# EAGLE design AnalogInputModule2_r1_1 (EAGLE 9.6.2)
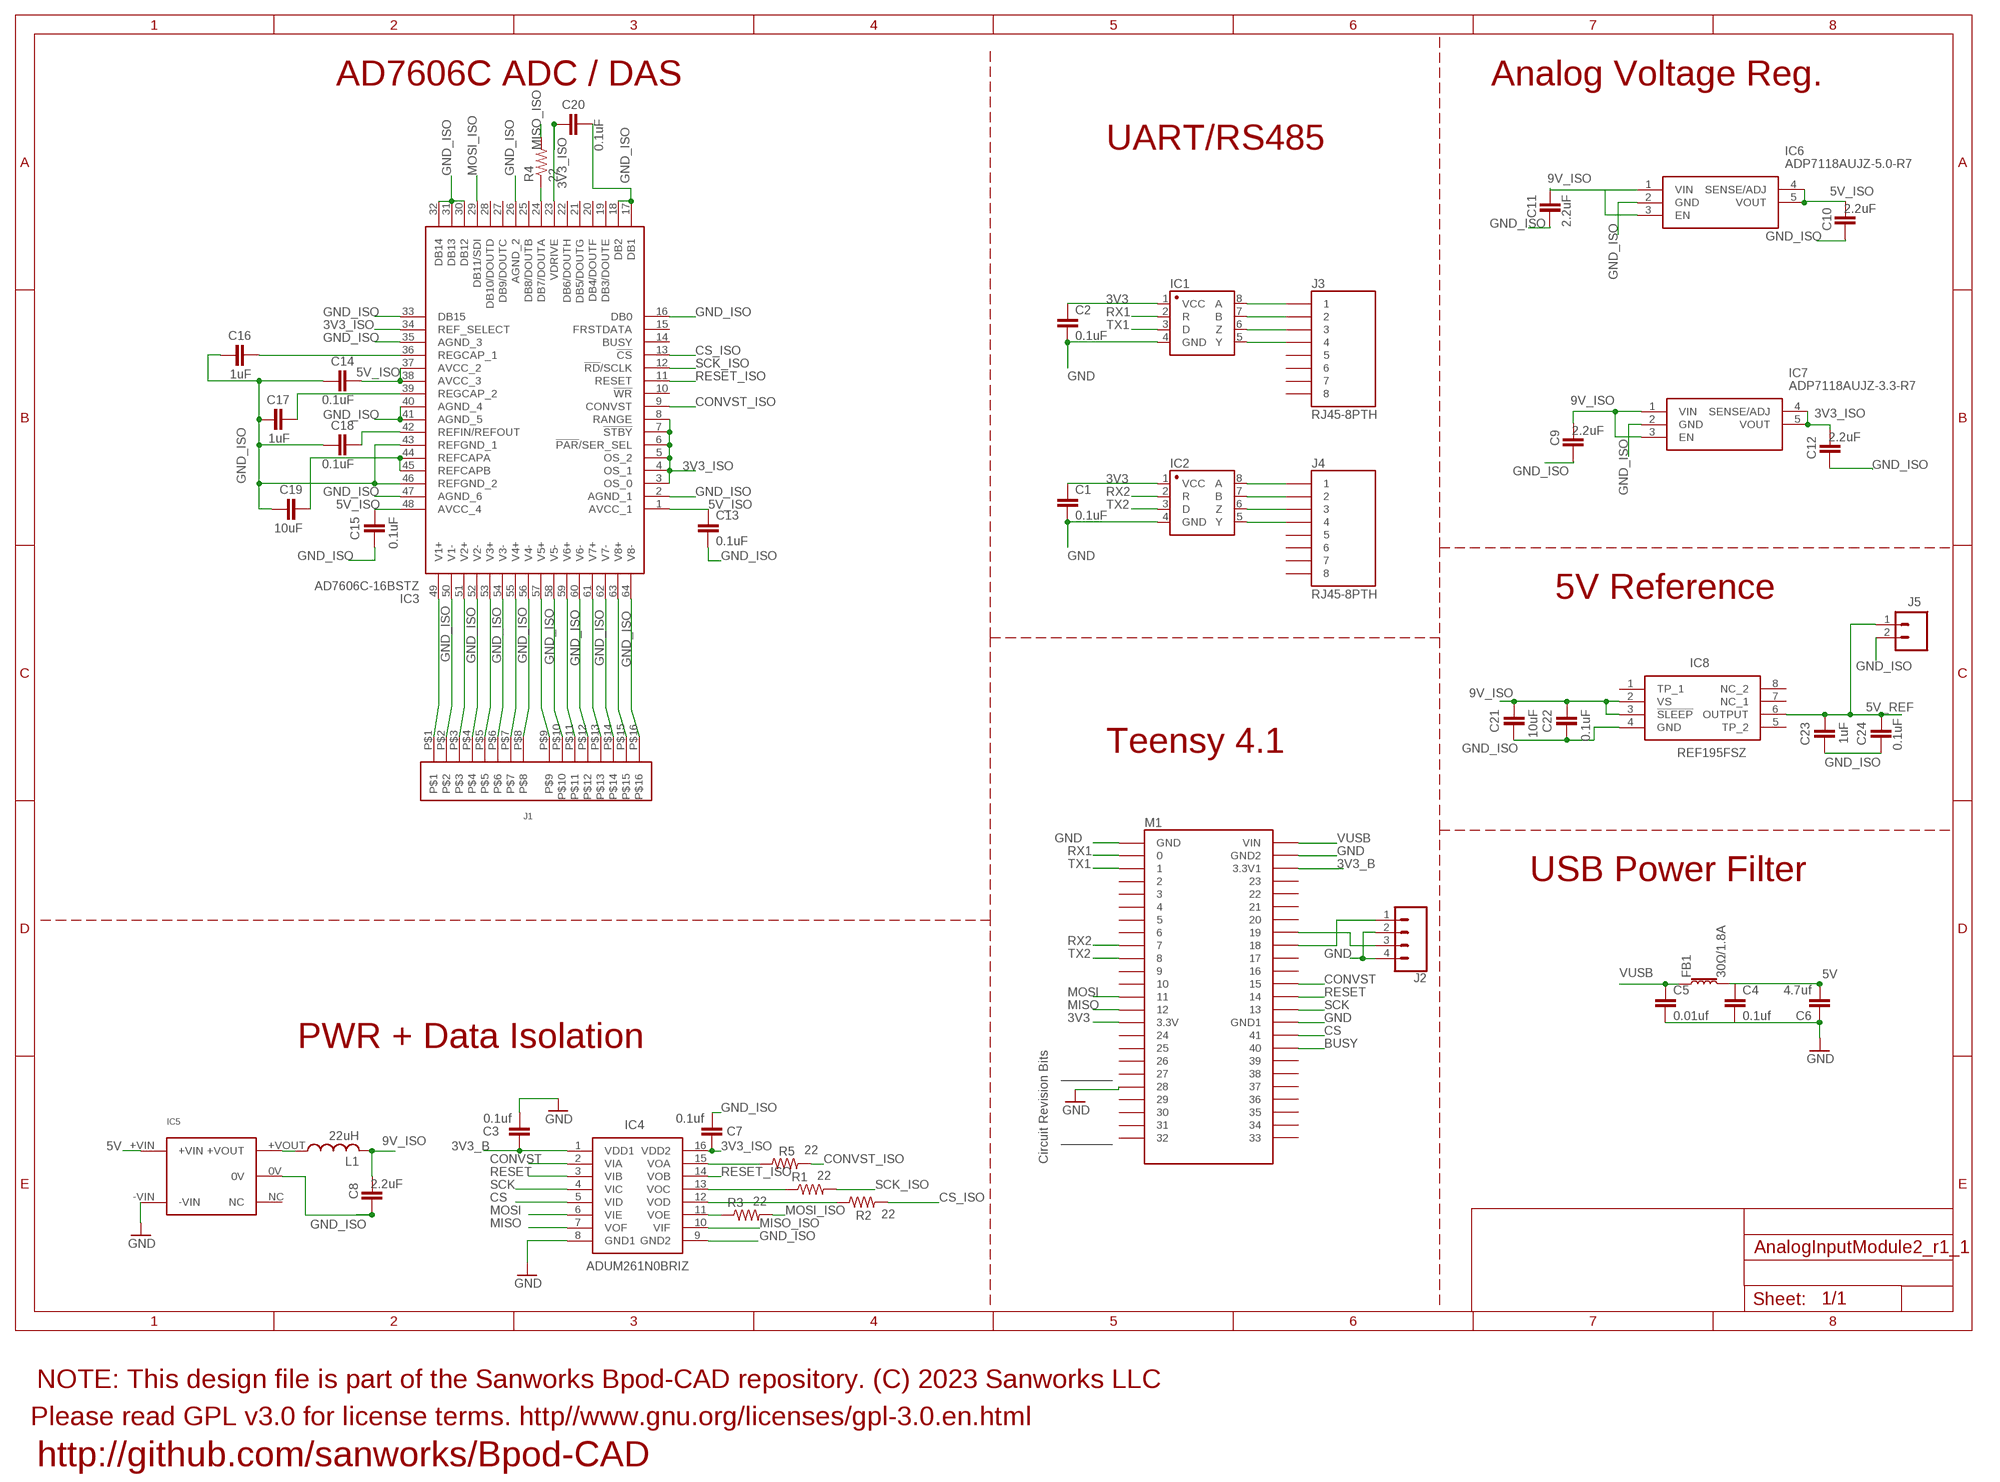
[diagram p0: schematic, sheet 1]

## Parts
C1  0.1uF  1.0UF-0805-25V-10%  [0805]
C2  0.1uF  1.0UF-0805-25V-10%  [0805]
C3  0.1uf  1.0UF-0805-25V-10%  [0805]
C4  0.1uf  10UF-0805-10V-10%  [0805]
C5  0.01uf  10UF-0805-10V-10%  [0805]
C6  4.7uf  CAP1206  [1206@2]
C7  0.1uf  1.0UF-0805-25V-10%  [0805]
C8  2.2uF  1.0UF-0805-25V-(+80/-20%)  [0805]
C9  2.2uF  1.0UF-0805-25V-(+80/-20%)  [0805]
C10  2.2uF  1.0UF-0805-25V-(+80/-20%)  [0805]
C11  2.2uF  1.0UF-0805-25V-(+80/-20%)  [0805]
C12  2.2uF  1.0UF-0805-25V-(+80/-20%)  [0805]
C13  0.1uF  1.0UF-0805-25V-10%  [0805]
C14  0.1uF  1.0UF-0805-25V-10%  [0805]
C15  0.1uF  1.0UF-0805-25V-10%  [0805]
C16  1uF  1.0UF-0805-25V-10%  [0805]
C17  1uF  1.0UF-0805-25V-10%  [0805]
C18  0.1uF  1.0UF-0805-25V-10%  [0805]
C19  10uF  1.0UF-0805-25V-10%  [0805]
C20  0.1uF  1.0UF-0805-25V-10%  [0805]
C21  10uF  1.0UF-0805-25V-10%  [0805]
C22  0.1uF  1.0UF-0805-25V-10%  [0805]
C23  1uF  1.0UF-0805-25V-10%  [0805]
C24  0.1uF  1.0UF-0805-25V-10%  [0805]
FB1  30Ω/1.8A  FERRITE_BEAD-0603  [0603]
IC1  SN65HVD31DR  [SO08]
IC2  SN65HVD31DR  [SO08]
IC3  AD7606C-16BSTZ  [QFP50P1200X1200X160-64N]
IC4  ADUM261N0BRIZ  [SOIC127P1030X264-16N]
IC5  5V  MTU1D0505MC  [MTU1D0505MC]
IC6  ADP7118AUJZ-5.0-R7  [SOT95P280X100-5N]
IC7  ADP7118AUJZ-3.3-R7  [SOT95P280X100-5N]
IC8  REF195FSZ  [SOIC127P600X175-8N]
J1  16POS_MOLEX_SOCKET  [16POS_MOLEX_SOCKET]
J2  CONN_04SCREW_LOCK  [SCREWTERMINAL-3.5MM-4_LOCK]
J3  RJ45-8PTH  [RJ45-8]
J4  RJ45-8PTH  [RJ45-8]
J5  CONN_023.5MM_LOCK  [SCREWTERMINAL-3.5MM-2_LOCK]
L1  22uH  L-USL3225M  [L3225M]
M1  TEENSY4.1_SIDESONLY  [TEENSY4.1_SIDESONLY]
R1  22  R-US_R0805  [R0805]
R2  22  R-US_R0805  [R0805]
R3  22  R-US_R0805  [R0805]
R4  22  R-US_R0805  [R0805]
R5  22  R-US_R0805  [R0805]

## Nets
3V3: C1.1 C2.1 IC1.1(VCC) IC2.1(VCC) M1.3V3(3.3V)
3V3_B: C3.1 IC4.1(VDD1) M1.3V3_LO(3.3V1)
3V3_ISO: C7.1 C12.2 C20.1 IC3.3(OS_0) IC3.4(OS_1) IC3.5(OS_2) IC3.6(!PAR!/SER_SEL) IC3.7(!STBY) IC3.8(RANGE) IC3.23(VDRIVE) IC3.34(REF_SELECT) IC4.16(VDD2) IC7.4(SENSE/ADJ) IC7.5(VOUT)
5V: C4.1 C6.2 FB1.2 IC5.+VIN
5V_ISO: C10.2 C13.1 C14.2 C15.2 IC3.1(AVCC_1) IC3.37(AVCC_2) IC3.38(AVCC_3) IC3.48(AVCC_4) IC6.4(SENSE/ADJ) IC6.5(VOUT)
5V_REF: C23.2 C24.2 IC8.6(OUTPUT) J5.1
9V_ISO: C8.2 C9.2 C11.2 C21.2 C22.2 IC6.1(VIN) IC6.3(EN) IC7.1(VIN) IC7.3(EN) IC8.2(VS) IC8.3(!SLEEP) L1.2
BUSY: M1.40
CONVST: IC4.2(VIA) M1.15/A1
CONVST_ISO: IC3.9(CONVST) R5.2
CS: IC4.5(VID) M1.41
CS_ISO: IC3.13(!CS) R2.2
GND: C1.2 C2.2 C3.2 C4.2 C5.2 C6.1 IC1.4(GND) IC2.4(GND) IC4.8(GND1) IC5.-VIN J2.2 J2.4 M1.28 M1.AGND(GND) M1.GND1(GND2) M1.GND(GND1)
GND_ISO: C7.2 C8.1 C9.1 C10.1 C11.1 C12.1 C13.2 C14.1 C15.1 C16.1 C17.1 C18.1 C19.1 C20.2 C21.1 C22.1 C23.1 C24.1 IC3.2(AGND_1) IC3.16(DB0) IC3.17(DB1) IC3.18(DB2) IC3.26(AGND_2) IC3.30(DB12) IC3.31(DB13) IC3.32(DB14) IC3.33(DB15) IC3.35(AGND_3) IC3.40(AGND_4) IC3.41(AGND_5) IC3.43(REFGND_1) IC3.46(REFGND_2) IC3.47(AGND_6) IC3.50(V1-) IC3.52(V2-) IC3.54(V3-) IC3.56(V4-) IC3.58(V5-) IC3.60(V6-) IC3.62(V7-) IC3.64(V8-) IC4.9(GND2) IC5.0V IC6.2(GND) IC7.2(GND) IC8.4(GND) J1.P$2 J1.P$4 J1.P$6 J1.P$8 J1.P$10 J1.P$12 J1.P$14 J1.P$16 J5.2
MISO: IC4.7(VOF) M1.12/MISO
MISO_ISO: IC4.10(VIF) R4.2
MOSI: IC4.6(VIE) M1.11/MOSI
MOSI_ISO: IC3.29(DB11/SDI) R3.2
N$1: IC1.6(Z) J3.3
N$3: IC1.8(A) J3.1
N$4: IC1.5(Y) J3.4
N$5: IC1.7(B) J3.2
N$6: IC2.6(Z) J4.3
N$7: IC2.5(Y) J4.4
N$8: IC2.8(A) J4.1
N$9: IC2.7(B) J4.2
N$11: IC3.63(V8+) J1.P$15
N$13: IC3.61(V7+) J1.P$13
N$15: IC3.59(V6+) J1.P$11
N$17: IC3.57(V5+) J1.P$9
N$19: IC3.55(V4+) J1.P$7
N$21: IC3.53(V3+) J1.P$5
N$23: IC3.51(V2+) J1.P$3
N$25: IC3.49(V1+) J1.P$1
N$27: IC4.13(VOC) R1.1
N$28: IC4.12(VOD) R2.1
N$29: IC4.11(VOE) R3.1
N$30: IC3.24(DB7/DOUTA) R4.1
N$31: IC4.15(VOA) R5.1
N$32: C16.2 IC3.36(REGCAP_1)
N$33: C17.2 IC3.39(REGCAP_2)
N$34: C18.2 IC3.42(REFIN/REFOUT)
N$35: C19.2 IC3.44(REFCAPA) IC3.45(REFCAPB)
N$36: J2.1 M1.18/A4/SDA
N$37: IC5.+VOUT L1.1
N$38: J2.3 M1.19/A5/SCL
RESET: IC4.3(VIB) M1.14/A0
RESET_ISO: IC3.11(RESET) IC4.14(VOB)
RX1: IC1.2(R) M1.0/RX
RX2: IC2.2(R) M1.7
SCK: IC4.4(VIC) M1.13/SCK
SCK_ISO: IC3.12(!RD!/SCLK) R1.2
TX1: IC1.3(D) M1.1/TX
TX2: IC2.3(D) M1.8
VUSB: C5.1 FB1.1 M1.VIN
Unconnected: IC3.10(!WR) IC3.14(BUSY) IC3.15(FRSTDATA) IC3.19(DB3/DOUTE) IC3.20(DB4/DOUTF) IC3.21(DB5/DOUTG) IC3.22(DB6/DOUTH) IC3.25(DB8/DOUTB) IC3.27(DB9/DOUTC) IC3.28(DB10/DOUTD) IC5.NC IC8.1(TP_1) IC8.5(TP_2) IC8.7(NC_1) IC8.8(NC_2) J3.5 J3.6 J3.7 J3.8 J4.5 J4.6 J4.7 J4.8 M1.2 M1.3 M1.4 M1.5 M1.6 M1.9 M1.10/CS M1.16/A2 M1.17/A3 M1.20/A6 M1.21/A7 M1.22/A8 M1.23/A9 M1.24 M1.25 M1.26 M1.27 M1.29 M1.30 M1.31/A12 M1.32 M1.33 M1.34 M1.35 M1.36 M1.37 M1.38 M1.39

## Notes on the sheet
- AD7606C ADC / DAS | Analog Voltage Reg.
- UART/RS485
- 5V Reference
- Teensy 4.1
- USB Power Filter
- PWR + Data Isolation
- Circuit Revision Bits
- NOTE: This design file is part of the Sanworks Bpod-CAD repository. (C) 2023 Sanworks LLC
- Please read GPL v3.0 for license terms. http//www.gnu.org/licenses/gpl-3.0.en.html
- http://github.com/sanworks/Bpod-CAD

## Library data of the parts
C1-C3 C7 C13-C24 = SparkFun-Capacitors:1.0UF: 1µF ceramic capacitors A capacitor is a passive two-terminal electrical component used to store electrical energy temporarily in an electric field.; PROD_ID: CAP-08064; VALUE: 1.0uF
C4 C5 = SparkFun-Capacitors:10UF: 10.0µF ceramic capacitors A capacitor is a passive two-terminal electrical component used to store electrical energy temporarily in an electric field.; PROD_ID: CAP-11330; VALUE: 10uF
C6 = SparkFun-Capacitors:CAP: Capacitor Standard 0603 ceramic capacitor, and 0.1" leaded capacitor.
C8-C12 = SparkFun-Capacitors:1.0UF: 1µF ceramic capacitors A capacitor is a passive two-terminal electrical component used to store electrical energy temporarily in an electric field.; PROD_ID: CAP-11625; VALUE: 1.0uF
FB1 = SparkFun-Coils:FERRITE_BEAD: Ferrite Bead (blocks, cores, rings, chokes, etc.) Inductor with layers of ferrite used to suppress high frequencies. Often used to isolate high frequency noise. SparkFun Products: IOIO-OTG - V2.2 <https://www.sparkfun.com/products/13613> SparkFun SAMD21 Mini Breakout <https://www.sparkfun.com/products/13664> SparkFun 6 Degrees of Freedom Breakout - LSM6DS3 <https://www.sparkfun.com/products/13339> SparkFun SAMD21 Dev Breakout <https://www.sparkfun.com/products/13672>; PROD_ID: NDUC-13805
IC1 IC2 = Joshparts4:SN65HVD31DR: A placeholder for generic narrow & wide SOIC8 foorptints - used on the DIP adapter board.
IC3 = AD7606C-16BSTZ:AD7606C-16BSTZ: 8-Channel Octal ADC SAR 1Msps 16-bit Parallel/Serial (3-Wire, SPI) 64-Pin LQFP T/R Source: Datasheet <https://www.arrow.com/en/products/ad7606c-16bstz/analog-devices>; DESCRIPTION: 8-Channel Octal ADC SAR 1Msps 16-bit Parallel/Serial (3-Wire, SPI) 64-Pin LQFP T/R; HEIGHT: 1.6mm; MANUFACTURER_NAME: Analog Devices; MANUFACTURER_PART_NUMBER: AD7606C-16BSTZ; MOUSER_PART_NUMBER: 584-AD7606C-16BSTZ; MOUSER_PRICE-STOCK: https://www.mouser.co.uk/ProductDetail/Analog-Devices/AD7606C-16BSTZ?qs=pUKx8fyJudAIi5elYfPn7w%3D%3D
IC4 = ADUM261N0BRIZ:ADUM261N0BRIZ: Digital Isolators Robust 5kV 6 CH digital ISO, 5/1 Source: Datasheet <https://www.analog.com/media/en/technical-documentation/data-sheets/ADuM260N-261N-262N-263N.pdf>; DESCRIPTION: Digital Isolators Robust 5kV 6 CH digital ISO, 5/1; HEIGHT: 2.64mm; MANUFACTURER_NAME: Analog Devices; MANUFACTURER_PART_NUMBER: ADUM261N0BRIZ; MOUSER_PART_NUMBER: 584-ADUM261N0BRIZ; MOUSER_PRICE-STOCK: https://www.mouser.co.uk/ProductDetail/Analog-Devices/ADUM261N0BRIZ?qs=OpCP5WdiozfBAczC%252BdQwOQ%3D%3D
IC5 = JoshParts10:MTU1D0505MC
IC6 = ADP7118AUJZ-5.0-R7:ADP7118AUJZ-5.0-R7: LDO Voltage Regulators 20V 200mA LDO 5.0Vo Source: Datasheet <https://www.analog.com/media/en/technical-documentation/data-sheets/adp7118.pdf>; DESCRIPTION: LDO Voltage Regulators 20V 200mA LDO 5.0Vo; HEIGHT: 1mm; MANUFACTURER_NAME: Analog Devices; MANUFACTURER_PART_NUMBER: ADP7118AUJZ-5.0-R7; MOUSER_PART_NUMBER: 584-ADP7118AUJZ5.0R7; MOUSER_PRICE-STOCK: https://www.mouser.co.uk/ProductDetail/Analog-Devices/ADP7118AUJZ-5.0-R7?qs=hpwIUhX6lWzp%252BHPslBdPxA%3D%3D
IC7 = ADP7118AUJZ-3.3-R7:ADP7118AUJZ-3.3-R7: LDO Regulator Pos 3.3V 0.2A 5-Pin TSOT-23 T/R Source: Datasheet <http://www.analog.com/media/en/technical-documentation/data-sheets/ADP7118.pdf>; DESCRIPTION: LDO Regulator Pos 3.3V 0.2A 5-Pin TSOT-23 T/R; HEIGHT: 1mm; MANUFACTURER_NAME: Analog Devices; MANUFACTURER_PART_NUMBER: ADP7118AUJZ-3.3-R7; MOUSER_PART_NUMBER: 584-ADP7118AUJZ3.3R7; MOUSER_PRICE-STOCK: https://www.mouser.co.uk/ProductDetail/Analog-Devices/ADP7118AUJZ-3.3-R7?qs=hpwIUhX6lWxSxNRE9lKdtQ%3D%3D
IC8 = REF195FSZ:REF195FSZ: REF195FSZ, Precision Voltage Reference 4.995 to 5.005V, 2mV 30mA 18V max. 8-Pin SOIC Source: Datasheet <https://datasheet.datasheetarchive.com/originals/distributors/SFDatasheet-4/sf-00085609.pdf>; DESCRIPTION: REF195FSZ, Precision Voltage Reference 4.995 to 5.005V, 2mV 30mA 18V max. 8-Pin SOIC; HEIGHT: 1.75mm; MANUFACTURER_NAME: Analog Devices; MANUFACTURER_PART_NUMBER: REF195FSZ; MOUSER_PART_NUMBER: 584-REF195FSZ; MOUSER_PRICE-STOCK: https://www.mouser.co.uk/ProductDetail/Analog-Devices/REF195FSZ?qs=WIvQP4zGanhjJxXxvDF9Xg%3D%3D
J1 = JoshParts10:16POS_MOLEX_SOCKET
J2 = SparkFun-Connectors:CONN_04: Multi connection point. Often used as Generic Header-pin footprint for 0.1 inch spaced/style header connections On any of the 0.1 inch spaced packages, you can populate with these: Break Away Headers - Straight <https://www.sparkfun.com/products/116> (PRT-00116) Break Away Male Headers - Right Angle <https://www.sparkfun.com/products/553> (PRT-00553) Female Headers <https://www.sparkfun.com/products/115> (PRT-00115) Break Away Headers - Machine Pin <https://www.sparkfun.com/products/117> (PRT-00117) Break Away Female Headers - Swiss Machine Pin <https://www.sparkfun.com/products/743> (PRT-00743) For SCREWTERMINALS and SPRING TERMINALS visit here: Screw Terimnals on SparkFun.com <https://www.sparkfun.com/search/results?term=Screw+Terminals> (5mm/3.5mm/2.54mm spacing) This device is also useful as a general connection point to wire up your design to another part of your project. Our various solder wires solder well into these plated through hole pads. Hook-Up Wire - Assortment (Stranded, 22 AWG) <https://www.sparkfun.com/products/11375> (PRT-11375) Hook-Up Wire - Assortment (Solid Core, 22 AWG) <https://www.sparkfun.com/products/11367> (PRT-11367) View the entire wire category on our website here <https://www.sparkfun.com/categories/141> Special notes: Molex polarized connector foot print use with SKU : PRT-08231 with associated crimp pins and housings. 1MM SMD Version SKU: PRT-10208
J3 J4 = SparkFun:RJ45-8: RJ45 Jack Simple RJ45, 8-pin connection - connector for common Cat5, Cat5e, and Cat6 Ethernet cables. Footprint not yet proven in production. Connector sku is PRT-00643; Breakout PCB sku is BOB-00716.
J5 = SparkFun-Connectors:CONN_02: Multi connection point. Often used as Generic Header-pin footprint for 0.1 inch spaced/style header connections On any of the 0.1 inch spaced packages, you can populate with these: Break Away Headers - Straight <https://www.sparkfun.com/products/116> (PRT-00116) Break Away Male Headers - Right Angle <https://www.sparkfun.com/products/553> (PRT-00553) Female Headers <https://www.sparkfun.com/products/115> (PRT-00115) Break Away Headers - Machine Pin <https://www.sparkfun.com/products/117> (PRT-00117) Break Away Female Headers - Swiss Machine Pin <https://www.sparkfun.com/products/743> (PRT-00743) For SCREWTERMINALS and SPRING TERMINALS visit here: Screw Terimnals on SparkFun.com <https://www.sparkfun.com/search/results?term=Screw+Terminals> (5mm/3.5mm/2.54mm spacing) This device is also useful as a general connection point to wire up your design to another part of your project. Our various solder wires solder well into these plated through hole pads. Hook-Up Wire - Assortment (Stranded, 22 AWG) <https://www.sparkfun.com/products/11375> (PRT-11375) Hook-Up Wire - Assortment (Solid Core, 22 AWG) <https://www.sparkfun.com/products/11367> (PRT-11367) View the entire wire category on our website here <https://www.sparkfun.com/categories/141> Special notes: Molex polarized connector foot print use with: PRT-08233 with associated crimp pins and housings. 2.54_SCREWTERM for use with PRT-10571. 3.5mm Screw Terminal footprints for PRT-08084 5mm Screw Terminal footprints for use with PRT-08432; PROD_ID: CONN-08399
L1 = rcl:L-US: INDUCTOR, American symbol
M1 = teensy4.1.dist:TEENSY4.1_SIDESONLY
R1-R5 = adafruit:R-US_: RESISTOR, American symbol

## Board
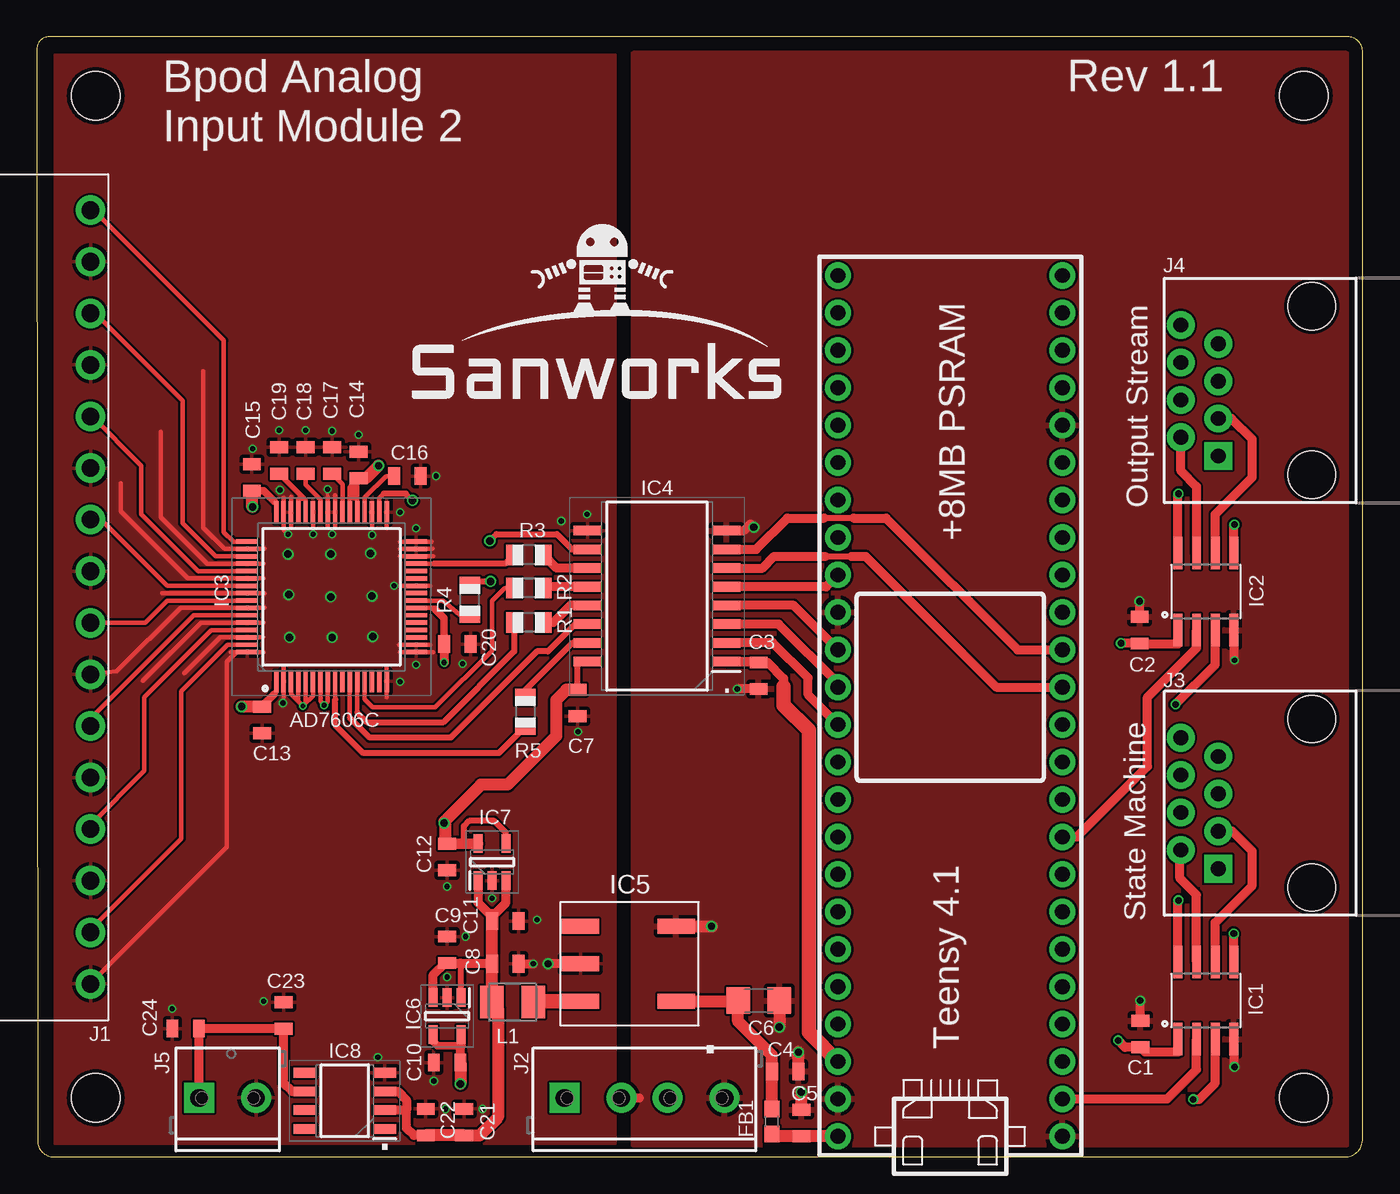
[diagram p1: board, top side]
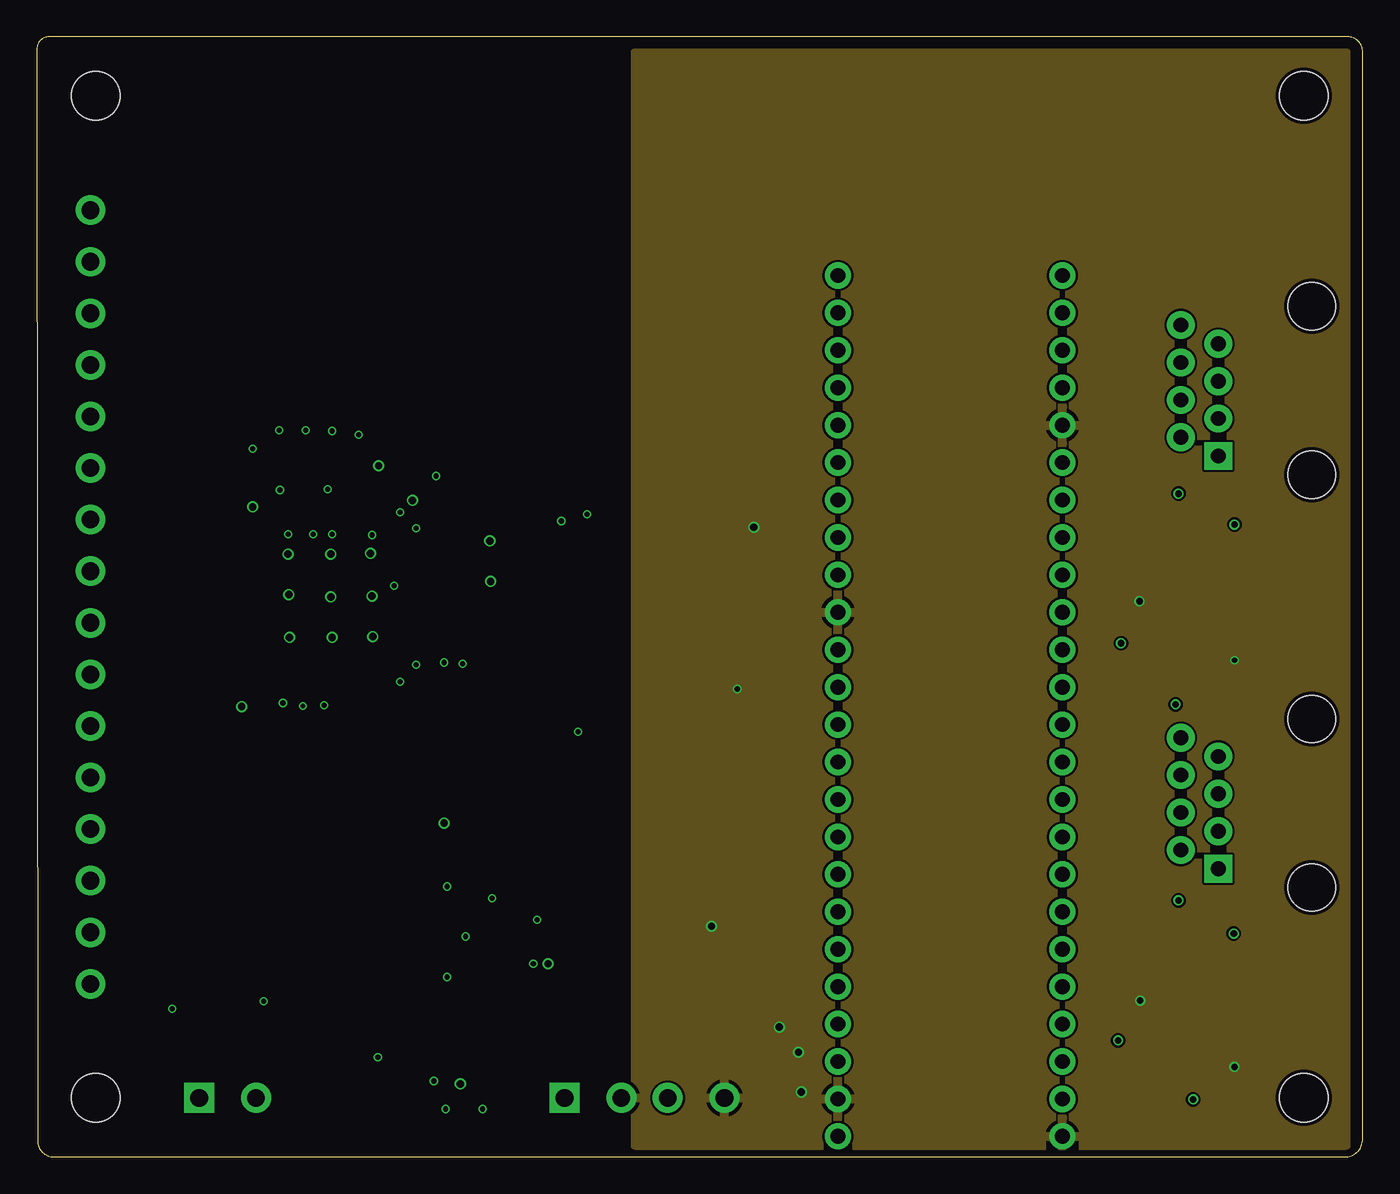
[diagram p2: board, inner layer Route2]
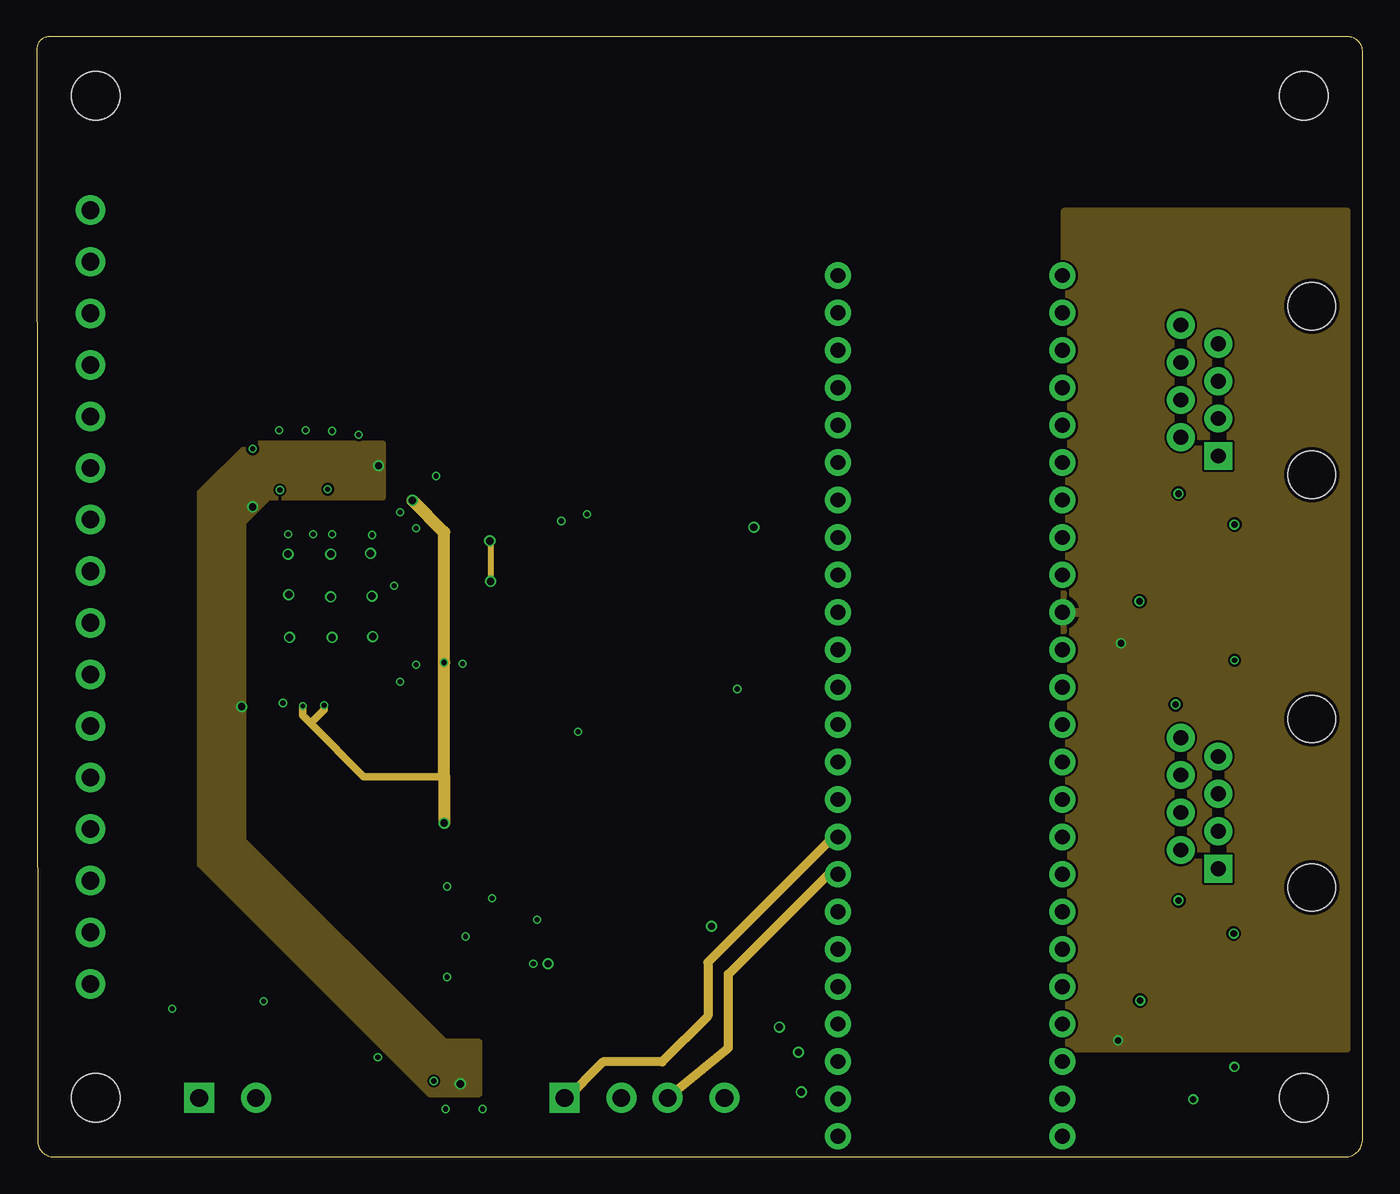
[diagram p3: board, inner layer Route15]
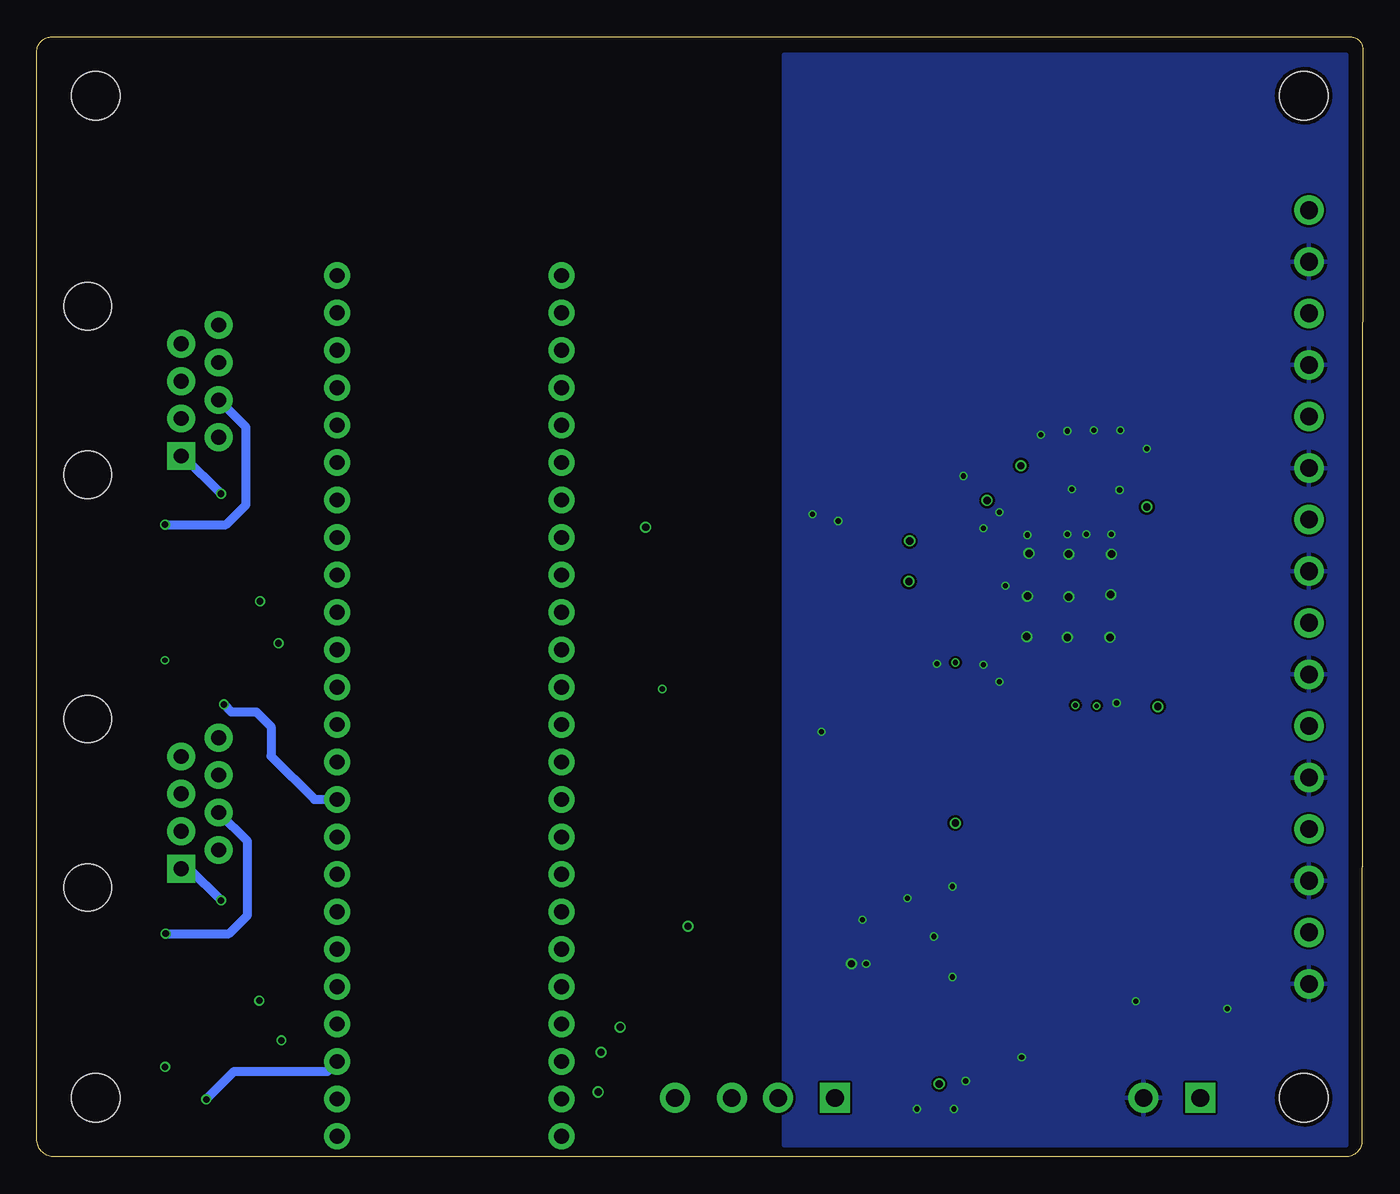
[diagram p4: board, bottom side, seen from below]

Size 90 x 76 mm. Coordinates in mm from the lower left corner, seen from the top.
Outline: 0,75.17 0.05,1.11 arc90 1.16,0 88.8,0 arc90 90,1.2 90,74.98 arc90 88.98,76 0.83,76 arc90 0,75.17
Copper layers (1*2*15*16): Top 0.035mm / dielectric 0.2mm / Route2 0.0175mm / dielectric 0.3mm / Route15 0.0175mm / dielectric 0.2mm / Bottom 0.035mm
Design rules "SeeedStudio_4layer_DRU_no_angle_20140221 *": minimum track width 8mil, minimum drill 12mil, track to track 6mil, track to pad 6mil, pad to pad 6mil, via to via 6mil, smd to smd 0mil, copper to edge 10mil, drill to drill 8mil, minimum pad ring 6mil, minimum via ring 4mil, stop-mask expansion 4mil, vias tented up to drill 25mil, thermal gap 10mil

### Footprints (pad centres in the part's own frame; a part is rotated, then mirrored left to right if it is on the bottom)
0805 = smd 0.8 x 1.2: 1 -0.9,0; 2 0.9,0
1206@2 = smd 1.6 x 1.8: 1 -1.4,0; 2 1.4,0
0603 = smd 1.1 x 1: 1 -0.85,0; 2 0.85,0
SO08 = smd 0.61 x 2.21: 1 -1.905,-2.616; 2 -0.635,-2.616; 3 0.635,-2.616; 4 1.905,-2.616; 5 1.905,2.616; 6 0.635,2.616; 7 -0.635,2.616; 8 -1.905,2.616
QFP50P1200X1200X160-64N = smd 1.475 x 0.3: 1 -5.738,3.75; 2 -5.738,3.25; 3 -5.738,2.75; 4 -5.738,2.25; 5 -5.738,1.75; 6 -5.738,1.25; 7 -5.738,0.75; 8 -5.738,0.25; 9 -5.738,-0.25; 10 -5.738,-0.75; 11 -5.738,-1.25; 12 -5.738,-1.75; 13 -5.738,-2.25; 14 -5.738,-2.75; 15 -5.738,-3.25; 16 -5.738,-3.75; 33 5.738,-3.75; 34 5.738,-3.25; 35 5.738,-2.75; 36 5.738,-2.25; 37 5.738,-1.75; 38 5.738,-1.25; 39 5.738,-0.75; 40 5.738,-0.25; 41 5.738,0.25; 42 5.738,0.75; 43 5.738,1.25; 44 5.738,1.75; 45 5.738,2.25; 46 5.738,2.75; 47 5.738,3.25; 48 5.738,3.75 | smd 0.3 x 1.475: 17 -3.75,-5.738; 18 -3.25,-5.738; 19 -2.75,-5.738; 20 -2.25,-5.738; 21 -1.75,-5.738; 22 -1.25,-5.738; 23 -0.75,-5.738; 24 -0.25,-5.738; 25 0.25,-5.738; 26 0.75,-5.738; 27 1.25,-5.738; 28 1.75,-5.738; 29 2.25,-5.738; 30 2.75,-5.738; 31 3.25,-5.738; 32 3.75,-5.738; 49 3.75,5.738; 50 3.25,5.738; 51 2.75,5.738; 52 2.25,5.738; 53 1.75,5.738; 54 1.25,5.738; 55 0.75,5.738; 56 0.25,5.738; 57 -0.25,5.738; 58 -0.75,5.738; 59 -1.25,5.738; 60 -1.75,5.738; 61 -2.25,5.738; 62 -2.75,5.738; 63 -3.25,5.738; 64 -3.75,5.738
SOIC127P1030X264-16N = smd 1.9 x 0.65: 1 -4.7,4.445; 2 -4.7,3.175; 3 -4.7,1.905; 4 -4.7,0.635; 5 -4.7,-0.635; 6 -4.7,-1.905; 7 -4.7,-3.175; 8 -4.7,-4.445; 9 4.7,-4.445; 10 4.7,-3.175; 11 4.7,-1.905; 12 4.7,-0.635; 13 4.7,0.635; 14 4.7,1.905; 15 4.7,3.175; 16 4.7,4.445
MTU1D0505MC = smd 2.54 x 1.016: 0V 6.502,0; +VIN 0,2.54; +VOUT 6.502,2.54; -VIN 0,-2.54; NC 6.502,-2.54
SOT95P280X100-5N = smd 1.25 x 0.6: 1 -1.25,0.95; 2 -1.25,0; 3 -1.25,-0.95; 4 1.25,-0.95; 5 1.25,0.95
SOIC127P600X175-8N = smd 1.525 x 0.65: 1 -2.712,1.905; 2 -2.712,0.635; 3 -2.712,-0.635; 4 -2.712,-1.905; 5 2.712,-1.905; 6 2.712,-0.635; 7 2.712,0.635; 8 2.712,1.905
16POS_MOLEX_SOCKET = drill 1.2 pad 2: P$1 -26.239,3.246; P$2 -22.739,3.246; P$3 -19.239,3.246; P$4 -15.739,3.246; P$5 -12.239,3.246; P$6 -8.739,3.246; P$7 -5.239,3.246; P$8 -1.739,3.246; P$9 1.761,3.246; P$10 5.261,3.246; P$11 8.761,3.246; P$12 12.261,3.246; P$13 15.761,3.246; P$14 19.261,3.246; P$15 22.761,3.246; P$16 26.261,3.246
SCREWTERMINAL-3.5MM-4_LOCK = drill 1.2 pad 2.032 square: 1 -0.178,0 | drill 1.2 pad 2.032: 2 3.678,0; 3 6.822,0; 4 10.678,0
RJ45-8 = drill 1 pad 1.88 square: 1 -4.445,6.35 | drill 1 pad 1.88: 2 -3.175,8.89; 3 -1.905,6.35; 4 -0.635,8.89; 5 0.635,6.35; 6 1.905,8.89; 7 3.175,6.35; 8 4.445,8.89 | hole 3.2: -5.715,0; 5.715,0
SCREWTERMINAL-3.5MM-2_LOCK = drill 1.2 pad 2.032 square: 1 -0.178,0 | drill 1.2 pad 2.032: 2 3.678,0
L3225M = smd 1.6 x 2.2: 1 -1.4,0; 2 1.4,0
TEENSY4.1_SIDESONLY = drill 1 pad 1.778: 0/RX -26.67,-7.62; 1/TX -24.13,-7.62; 2 -21.59,-7.62; 3 -19.05,-7.62; 3V3 6.35,-7.62; 3V3_LO -24.13,7.62; 4 -16.51,-7.62; 5 -13.97,-7.62; 6 -11.43,-7.62; 7 -8.89,-7.62; 8 -6.35,-7.62; 9 -3.81,-7.62; 10/CS -1.27,-7.62; 11/MOSI 1.27,-7.62; 12/MISO 3.81,-7.62; 13/SCK 3.81,7.62; 14/A0 1.27,7.62; 15/A1 -1.27,7.62; 16/A2 -3.81,7.62; 17/A3 -6.35,7.62; 18/A4/SDA -8.89,7.62; 19/A5/SCL -11.43,7.62; 20/A6 -13.97,7.62; 21/A7 -16.51,7.62; 22/A8 -19.05,7.62; 23/A9 -21.59,7.62; 24 8.89,-7.62; 25 11.43,-7.62; 26 13.97,-7.62; 27 16.51,-7.62; 28 19.05,-7.62; 29 21.59,-7.62; 30 24.13,-7.62; 31/A12 26.67,-7.62; 32 29.21,-7.62; 33 29.21,7.62; 34 26.67,7.62; 35 24.13,7.62; 36 21.59,7.62; 37 19.05,7.62; 38 16.51,7.62; 39 13.97,7.62; 40 11.43,7.62; 41 8.89,7.62; AGND -26.67,7.62; GND -29.21,-7.62; GND1 6.35,7.62; VIN -29.21,7.62
R0805 = smd 1.1 x 1.4: 1 -1,0; 2 1,0
STAND-OFF = hole 3.302: 0,0

### Placement (x,y rotation side)
C1  74.91,8.33 90 top
C2  74.86,35.74 90 top
C3  49,32.65 270 top
C4  50.8,5.8 0 top
C5  51.9,2.3 90 top
C6  49,10.6 180 top
C7  36.7,30.8 270 top
C8  31.8,13.1 180 top
C9  27.85,14.05 270 top
C10  27.85,6.4 0 top
C11  31.8,16 180 top
C12  27.85,20.35 90 top
C13  15.3,29.65 270 top
C14  21.85,46.95 270 top
C15  14.6,46.1 270 top
C16  25.15,46.2 180 top
C17  20.05,47.25 270 top
C18  18.25,47.25 270 top
C19  16.45,47.25 270 top
C20  28.55,34.8 0 top
C21  29,2.35 270 top
C22  26.4,2.35 270 top
C23  16.75,9.6 270 top
C24  10.1,8.7 0 top
FB1  49.9,2.4 90 top
IC1  79.36,10.61 0 top
IC2  79.36,38.36 0 top
IC3  20,38 90 top
IC4  42.1,38.05 180 top
IC5  43.4,13.1 180 top
IC6  27.85,9.55 270 top
IC7  30.9,20 90 top
IC8  20.9,3.8 180 top
J1  0.4,38 270 top
J2  36,4 0 top
J3  86.55,24 90 top
J4  86.55,52 90 top
J5  11.2,4 0 top
L1  32.3,10.5 180 top
M1  62,30.6 90 top
R1  33.4,36.25 180 top
R2  33.4,38.6 180 top
R3  33.4,40.85 180 top
R4  29.4,37.8 90 top
R5  33.15,30.2 270 top
U$1  [SANWORKS_LOGO]  25.2,51.25 0 top
U$5  [STAND-OFF]  4,4 0 top
U$6  [STAND-OFF]  86,4 0 top
U$7  [STAND-OFF]  4,72 0 top
U$8  [STAND-OFF]  86,72 0 top

### Tracks (layer width: path | path; a pad name or v marks a point on that pad's centre or on a via)
3V3  (via drill 0.45)
  Top 0.6: IC2.1 77.45,34.8 74.86,34.8 C2.1 v73.6,34.84 v73.6,34.85 | IC1.1 77.45,7.1 75.24,7.1 C1.1 73.87,7.43 v73.4,7.9
  pour Route15: 69.8,7.4 88.9,7.4 88.9,64.1 69.8,64.1
3V3_B
  Top 0.6: 49.05,33.55 C3.1 49.6,33.55 50.7,32.45 50.7,31.9
  Top 0.65: IC4.1 48.94,33.6 C3.1
  Top 1: M1.3V3_LO 52.4,8.45 52.4,28.95 50.7,30.65 50.7,31.9
3V3_ISO  (via drill 0.3, 0.35, 0.5)
  Top 0.3: 23.55,45 23.25,44.7 IC3.34 | IC3.3 17.25,31.4 17.75,30.9 | 18.75,31.4 IC3.6 18.75,31.3 v18.05,30.6 | IC3.5 18.25,30.8 v18.05,30.6 | IC3.4 17.75,30.9 | 17.75,30.9 v18.05,30.6 | IC3.7 19.25,30.9 v19.5,30.65 19.75,30.9 19.75,31.26 IC3.8 | IC4.16 36.7,33.6 | 27.05,37.15 26.95,37.25 IC3.23
  Top 0.4: C7.1 36.7,33.6 | IC7.4 31.85,22 31.05,22.8 29.35,22.8 29,22.45 29,21.25 | v25.5,44.55 25.05,45 23.55,45
  Top 0.5: C20.1 27.65,36.55 27.05,37.15
  Top 0.6: C20.1 v27.65,33.55
  Top 0.7: C12.2 29,21.25 IC7.5
  Top 0.8: C7.1 35.95,31.7 35.25,31 35.25,28.55 31.95,25.25 30.15,25.25 27.65,22.75 v27.65,22.65 27.7,22.6 27.7,21.4 C12.2
  Route15 0.5: v18.05,30.6 18.05,29.95 18.57,29.43 | 27.65,25.8 22.2,25.8 18.57,29.43 | v19.5,30.65 19.5,30.35 18.57,29.43
  Route15 0.8: v27.65,22.65 27.65,25.8 v27.65,33.55 27.65,42.4 v25.5,44.55
5V
  Top 0.7: 47.56,10.56 C6.2
  Top 0.8: FB1.2 C4.1 49.9,6.9 47.6,9.2 C6.2 | IC5.+VIN 47.56,10.56
5V_ISO  (via drill 0.5)
  Top 0.3: IC3.38 21.25,45.45 21.57,45.77 | IC3.37 21.75,45.95 C14.2 | 16.1,31.4 16.15,31.4 16.25,31.5 IC3.1 | IC3.48 16.25,44.45 16.2,44.5 16.1,44.5
  Top 0.5: 26.9,7.85 27.2,7.55 28.8,7.55 | C13.1 15.3,30.6 16.1,31.4 | 16.1,44.5 15.4,45.2 C15.2 | 21.57,45.77 C14.2 21.5,45.7 21.5,44.8
  Top 0.6: IC6.5 28.8,7.6 | 28.8,7.6 28.8,7.55 | 28.8,6.45 C10.2 28.75,7.55 28.8,7.6 | IC6.4 26.9,7.85
  Top 0.8: C10.2 v28.75,4.95 | C13.1 v13.9,30.55 | C15.2 14.6,44.15 v14.65,44.1 | C14.2 22.35,46.05 v23.2,46.9
  pour Route15: 30.05,4.25 30.05,7.8 27.7,7.8 14.05,21.45 14.05,43.05 15.75,44.75 23.5,44.75 23.5,48.4 14.4,48.4 11.05,45.05 11.05,19.85 26.65,4.25
5V_REF
  Top 0.6: IC8.6 17.31,4.43 16.75,5 C23.2 C24.2 11,4.02 J5.1
9V_ISO
  Top 0.4: 30.85,13.15 C8.2 | 27.7,13.15 C9.2 | IC6.1 28.8,13.1 28.75,13.15
  Top 0.6: C9.2 28.75,13.15 30.85,13.15 | 27.7,13.15 26.9,12.35 IC6.3 | IC7.3 31.85,17.25 31.1,16.5 30.9,16.5 | IC7.1 29.95,17.25 30.7,16.5 30.9,16.5 | 30.9,16.5 C11.2 | C22.2 25.6,1.45 25.1,1.95 25.1,3.17 | 25.1,3.17 IC8.2 | IC8.3 24.51,4.43 25.1,3.85 25.1,3.17
  Top 0.8: C11.2 C8.2 L1.2 31.3,10.1 31.3,2.7 30.05,1.45 C21.2 C22.2
CONVST
  Top 0.4: 46.82,34.9 IC4.2
  Top 0.6: M1.15/A1 52.35,31.36 52.35,32.5 49.95,34.9 46.82,34.9
CONVST_ISO
  Top 0.3: 20.25,31.05 IC3.9
  Top 0.4: R5.2 31.35,27.4 22.15,27.4 20.25,29.3 20.25,31.05
CS
  Top 0.6: M1.41 53.57,38.69 IC4.5
CS_ISO
  Top 0.3: IC3.13 22.25,31.05 22.8,30.5 27.05,30.5 30.9,34.35 30.9,37.75 31.75,38.6 R2.2
GND  (via drill 0.35, 0.45, 0.5)
  Top 0.6: IC1.4 81.26,6.13 v81.3,6.1 | C1.2 v74.9,10.6 | IC2.4 81.26,33.73 v81.3,33.7 | C3.2 v47.55,31.75 | IC4.8 47.99,42.49 48.45,42.95 v48.67,42.73 | C2.2 v74.85,37.7 | 39.8,4 40.9,4
  Top 0.7: v45.8,15.64 v45.8,15.65
  Top 0.8: C6.1 v50.4,8.8 | C4.2 v51.7,7.1 | C5.2 v51.9,4.4 | IC5.-VIN v45.8,15.64
  pour Route2: 40.6,0.8 88.9,0.8 88.9,74.9 40.6,74.9
  pour Top: 40.5,0.85 88.9,0.85 88.9,74.85 40.5,74.85
GND_ISO  (via drill 0.35, 0.5)
  Top 0.203: IC3.41 19.75,44.79 v19.75,45.3
  Top 0.3: v17.05,42.25 16.75,42.55 IC3.47 16.75,44.74 | 17.25,43.2 17.25,42.7 | 18.75,43.2 18.75,42.7 | 19.75,43.2 19.75,42.7 | 20.25,43.2 20.25,42.7 | 22.75,43.15 22.75,42.65 | 23.75,43.15 23.75,42.65 | 24.65,41.75 25.15,41.75 | 24.65,41.25 25.15,41.25 | 24.65,40.75 25.15,40.75 | 24.65,38.75 25.15,38.75 | 24.6,34.75 25.1,34.75 | 24.65,34.25 25.15,34.25 | 23.75,32.8 23.75,33.3 | 16.75,32.8 16.75,33.3 | 16.75,31.2 16.75,31.7 | 23.75,31.2 23.75,31.7 | 26.3,41.75 26.8,41.75 | 26.35,41.25 26.85,41.25 | 26.4,40.75 26.9,40.75 | 26.2,34.75 26.7,34.75 | 26.4,34.25 26.9,34.25 | 17.25,44.79 17.25,43.6 | 20.25,44.89 20.25,43.7 | 19.75,44.79 19.75,43.6 | 26.2,38.75 26.7,38.75 | IC3.50 12.75,41.25 11.3,42.7 11.3,53.3 | 3.66,60.94 J1.P$2 | IC3.52 11.55,40.25 8.4,43.4 8.4,49.2 | 3.66,53.94 J1.P$4 | IC3.54 10.25,39.25 5.7,43.8 5.7,45.7 | 4.41,46.71 J1.P$6 | IC3.56 8.5,38.25 | IC3.58 9.75,37.25 5.44,32.94 J1.P$10 | IC3.60 11.15,36.25 7.2,32.3 | J1.P$12 3.65,25.95 | IC3.62 12.45,35.25 10,32.8 | IC3.64 13.65,34.25 | 13.65,34.25 13.55,34.25 12.9,33.6 12.9,21 3.84,11.94 J1.P$16 | 14.95,41.25 15.45,41.25 | 14.9,40.25 15.4,40.25 | 14.9,39.25 15.4,39.25 | 14.95,38.25 15.45,38.25 | 14.95,37.25 15.45,37.25 | 14.9,36.25 15.4,36.25 | 14.85,35.25 15.35,35.25 | 14.9,34.25 15.4,34.25 | 13.15,34.25 13.65,34.25
  Top 0.6: IC5.0V v34.7,13.1 | C8.1 v33.7,13.1
  other vias: 27.1,46.2 24.25,38.75 16.7,30.8 36.75,28.85 26.95,5.15 27.85,12.2 29.1,14.95 33.95,16.1 30.9,17.55 27.85,18.35 14.65,48.05 21.85,49 20.05,49.25 17.05,40.9 19.95,40.9 22.65,40.95 17.1,38.15 19.95,38 22.75,38.05 17.15,35.25 20.05,35.25 22.8,35.3 24.65,32.25 25.75,33.4 25.75,42.65 24.65,43.75 18.25,49.3 16.45,49.3 16.5,45.25 18.75,42.25 20.05,42.25 22.75,42.2 37.35,43.6 35.6,43.15 28.9,33.45 23.15,6.75 27.75,3.25 30.25,3.25 15.4,10.55 9.2,10.05
  pour Bottom: 1.1,0.8 39.3,0.8 39.3,74.8 1.1,74.8
  pour Top: 1.2,0.9 39.3,0.9 39.3,74.8 1.2,74.8
MISO
  Top 0.4: 53.45,43.35 53.47,43.33 55.43,43.33 55.45,43.35
  Top 0.6: M1.12/MISO 66.59,34.41 57.65,43.35 55.45,43.35 | IC4.7 48.82,41.23 50.95,43.35 53.45,43.35
MISO_ISO  (via drill 0.5)
  Top 0.4: R4.2 29.65,39.05 v30.8,39.05 | v30.75,41.8 31.2,42.25 35.3,42.25 36.32,41.23 IC4.10
  Route15 0.4: v30.75,41.8 30.8,41.75 v30.8,39.05
MOSI
  Top 0.4: 53.5,40.75 55.3,40.75
  Top 0.6: M1.11/MOSI 65.13,31.87 56.25,40.75 55.3,40.75 | IC4.6 49.25,39.95 50.05,40.75 53.5,40.75
MOSI_ISO
  Top 0.3: 27,40.25 IC3.29
  Top 0.4: R3.2 31.8,40.25 27,40.25
N$1
  Top 0.6: IC1.6 79.99,15.89 82.5,18.4 82.5,20.75 81.15,22.1 J3.3
N$3  (via drill 0.45)
  Top 0.6: IC1.8 77.45,17.36 v77.5,17.4
  Bottom 0.6: J3.1 79.65,19.55 v77.5,17.4
N$4  (via drill 0.45)
  Top 0.6: IC1.5 81.26,15.06 81.3,15.1 v81.25,15.15
  Bottom 0.6: v81.25,15.15 76.95,15.15 75.7,16.4 75.7,21.41 J3.4
N$5
  Top 0.6: IC1.7 78.72,17.77 77.6,18.9 77.6,20.77 J3.2
N$6
  Top 0.6: IC2.6 79.99,43.59 82.5,46.1 82.5,48.7 81.1,50.1 J4.3
N$7  (via drill 0.45)
  Top 0.6: IC2.5 81.26,42.87 v81.3,42.9
  Bottom 0.6: v81.3,42.9 77.15,42.9 75.8,44.25 75.8,49.51 J4.4
N$8  (via drill 0.45)
  Top 0.6: IC2.8 77.45,44.95 v77.5,45
  Bottom 0.6: J4.1 80.05,47.55 v77.5,45
N$9
  Top 0.6: IC2.7 78.72,45.48 77.66,46.54 J4.2
N$11
  Top 0.3: IC3.63 12.95,34.75 9.8,31.6 9.8,21.6 3.65,15.45 J1.P$15
N$13
  Top 0.3: IC3.61 11.85,35.75 7.3,31.2 7.3,26.2 3.65,22.55 J1.P$13
N$15
  Top 0.3: IC3.59 10.65,36.75 3.65,29.75 J1.P$11
N$17
  Top 0.3: IC3.57 8.85,37.75 7.35,36.25 J1.P$9
N$19
  Top 0.3: IC3.55 8.85,38.75 4.26,43.34 J1.P$7
N$21
  Top 0.3: IC3.53 10.95,39.75 7.1,43.6 7.1,46.9 3.65,50.35 J1.P$5
N$23
  Top 0.3: IC3.51 12.15,40.75 9.9,43 9.9,51.3 3.76,57.44 J1.P$3
N$25
  Top 0.3: IC3.49 13.35,41.75 12.7,42.4 12.7,55.4 3.66,64.44 J1.P$1
N$27
  Top 0.6: IC4.13 36.21,37.41 35.05,36.25 R1.1
N$28
  Top 0.6: IC4.12 34.48,38.69 R2.1
N$29
  Top 0.6: IC4.11 35.29,39.95 R3.1
N$30
  Top 0.3: IC3.24 27.58,37.75 28.71,36.8 R4.1
N$31
  Top 0.4: IC4.15 36.37,34.88 33.15,31.65 R5.1
N$32
  Top 0.3: IC3.36 22.25,44.75 23.7,46.2 C16.2
N$33
  Top 0.3: IC3.39 20.75,45.65 C17.2
N$34
  Top 0.3: IC3.42 19.25,44.6 18.25,45.6 C18.2
N$35
  Top 0.3: IC3.45 17.75,44.65 18.15,44.65 18.25,44.55 IC3.44
  Top 0.35: 18.15,44.65 C19.2
N$36
  Route15 0.6: M1.18/A4/SDA 54.06,21.71 45.55,13.2 45.55,9.55 42.45,6.45 38.45,6.45 35.82,3.82 J2.1
N$37
  Top 1: IC5.+VOUT 33.76,10.56 L1.1
N$38
  Route15 0.6: J2.3 46.87,7.35 46.9,7.35 46.95,7.4 46.95,12.4 53.72,19.17 M1.19/A5/SCL
RESET
  Top 0.4: M1.14/A0 54.38,32.12
  Top 0.6: 54.38,32.12 50.35,36.15 IC4.3
RESET_ISO
  Top 0.3: IC3.11 21.25,30.36 21.25,29.8
  Top 0.4: IC4.14 36.54,36.15 34.7,34.3 33.95,34.3 28.1,28.45 22.6,28.45 21.25,29.8
RX1
  Top 0.6: M1.0/RX 76.73,3.93 78.72,5.92 IC1.2
RX2
  Top 0.6: M1.7 70.61,21.71 75.4,26.5 75.4,31.2 77.5,33.3 78.72,34.52 IC2.2
SCK
  Top 0.6: M1.13/SCK 51.37,37.41 IC4.4
SCK_ISO
  Top 0.3: IC3.12 21.75,30.15
  Top 0.4: 21.75,30.15 22.4,29.5 27.6,29.5 32.4,34.3 R1.2
TX1  (via drill 0.45)
  Top 0.6: IC1.3 79.99,5 78.9,3.9 v78.5,3.9
  Bottom 0.6: v78.5,3.9 76.6,5.8 70.29,5.8 M1.1/TX
TX2  (via drill 0.45)
  Top 0.6: v77.3,30.7 79.99,33.4 IC2.3
  Bottom 0.6: v77.3,30.7 76.8,30.2 75.1,30.2 74.1,29.2 74.1,27.2 71.15,24.25 M1.8
VUSB
  Top 0.7: M1.VIN | 50.05,1.4 FB1.1
  Top 0.8: M1.VIN C5.1 50.05,1.4

### Text on the board
tPlace: J4 | Output Stream | +8MB PSRAM | J3 | . | AD7606C | State Machine | Teensy 4.1 | .
tNames: Bpod Analog | Rev 1.1 | Input Module 2